# Altium schematic sheet FMU_FMU_REV_1B.SchDoc: The Cube TM
size A3; DrawnBy: Philip Rowse; SheetNumber: 1; SheetTotal: 10
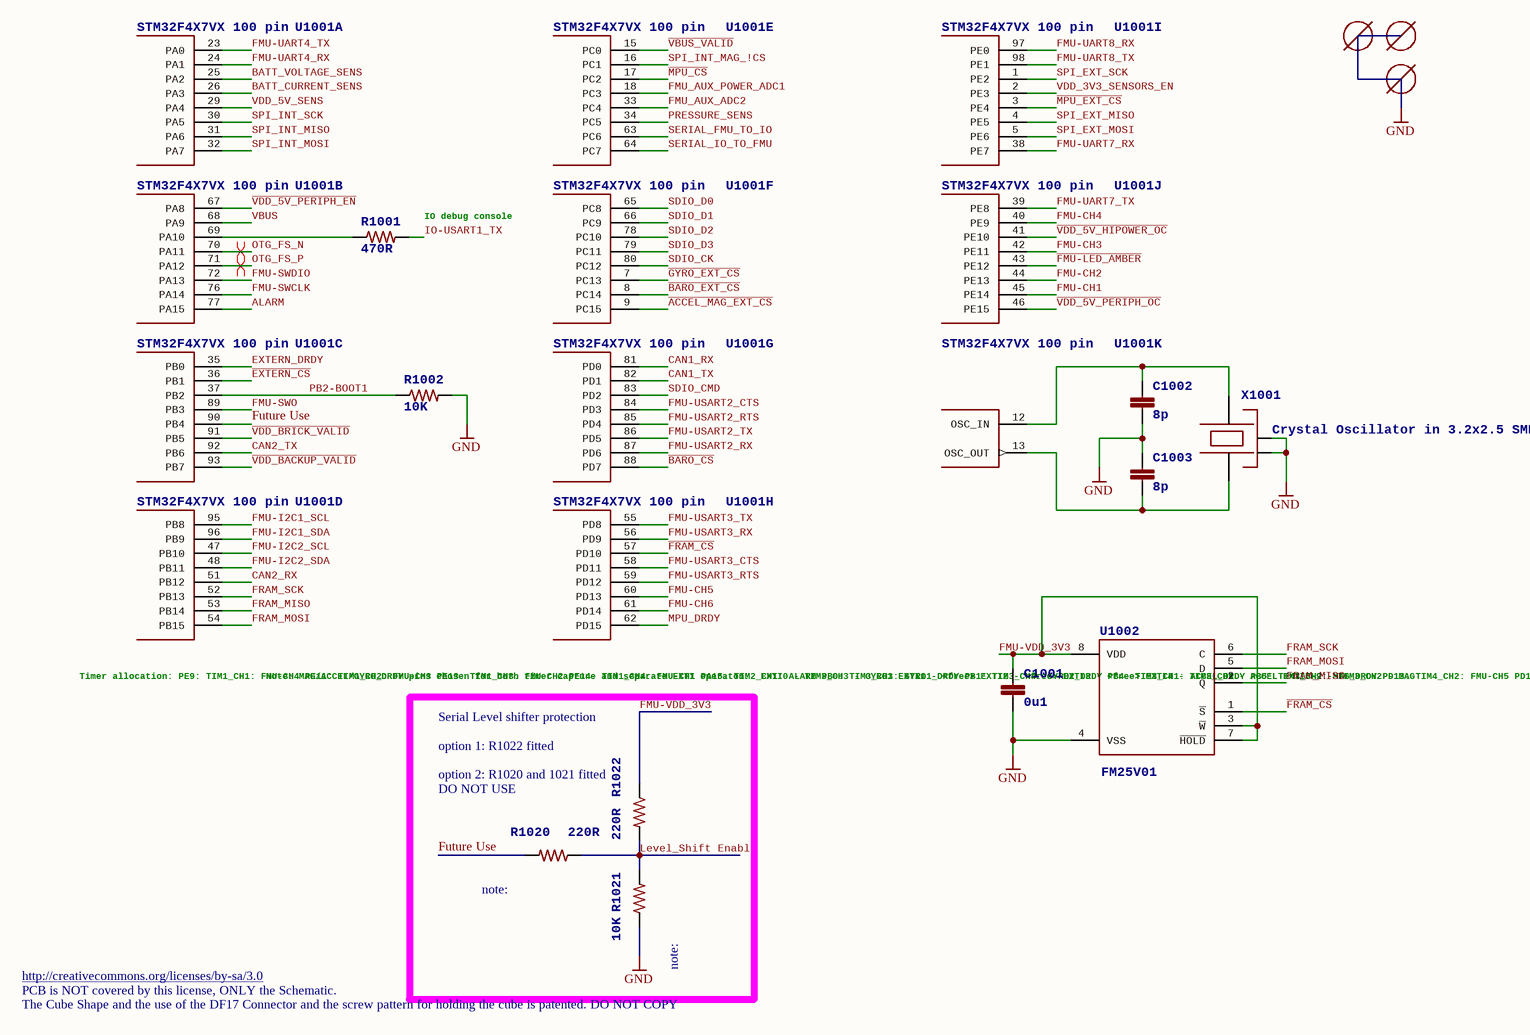
[diagram p0: FMU_FMU_REV_1B.SchDoc]

## Parts
C1001  0u1  [0402-CAP]
C1002  8p  [0402-CAP]
C1003  8p  [0402-CAP]
M3_MOUNT1001  MOUNT-HOLE1.8MM  [MOUNT-HOLE1.8]  (value not drawn)
M3_MOUNT1003  MOUNT-HOLE1.8MM  [MOUNT-HOLE1.8]  (value not drawn)
M3_MOUNT1004  MOUNT-HOLE1.8MM  [MOUNT-HOLE1.8]  (value not drawn)
R1001  470R  [0402-RES]
R1002  10K  [0402-RES]
R1020  220R  [0402-RES]
R1021  10K  [0402-RES]
R1022  220R  [0402-RES]
U1001  STM32F4X7VX 100 pin  [TQFP100]  (parts A,B,C,D,E,F,G,H,I,J,K of 14)
U1002  FM25V01  [SO08]
X1001  Crystal Oscillator in 3.2x2.5 SMD  [OSCILLATOR-3.2X2.5]

## Nets
GND: C1001.P$2 C1002.P$2 C1003.P$1 R1002.P$2 R1021.P$1 U1002.4(VSS) X1001.2(NC_2) X1001.4(NC_4)
~{ACCEL_MAG_EXT_CS}: U1001.9(PC15)
ALARM: U1001.77(PA15)
~{BARO_CS}: U1001.88(PD7)
~{BARO_EXT_CS}: U1001.8(PC14)
BATT_CURRENT_SENS: U1001.26(PA3)
BATT_VOLTAGE_SENS: U1001.25(PA2)
CAN1_RX: U1001.81(PD0)
CAN1_TX: U1001.82(PD1)
CAN2_RX: U1001.51(PB12)
CAN2_TX: U1001.92(PB6)
~{EXTERN_CS}: U1001.36(PB1)
EXTERN_DRDY: U1001.35(PB0)
~{FMU-LED_AMBER}: U1001.43(PE12)
~{FRAM_CS}: U1001.57(PD10) U1002.1(~{S})
FMU-CH1: U1001.45(PE14)
FMU-CH2: U1001.44(PE13)
FMU-CH3: U1001.42(PE11)
FMU-CH4: U1001.40(PE9)
FMU-CH5: U1001.60(PD13)
FMU-CH6: U1001.61(PD14)
FMU-I2C1_SCL: U1001.95(PB8)
FMU-I2C1_SDA: U1001.96(PB9)
FMU-I2C2_SCL: U1001.47(PB10)
FMU-I2C2_SDA: U1001.48(PB11)
FMU-SWCLK: U1001.76(PA14)
FMU-SWDIO: U1001.72(PA13)
FMU-SWO: U1001.89(PB3)
FMU-UART4_RX: U1001.24(PA1)
FMU-UART4_TX: U1001.23(PA0)
FMU-UART7_RX: U1001.38(PE7)
FMU-UART7_TX: U1001.39(PE8)
FMU-UART8_RX: U1001.97(PE0)
FMU-UART8_TX: U1001.98(PE1)
FMU-USART2_CTS: U1001.84(PD3)
FMU-USART2_RTS: U1001.85(PD4)
FMU-USART2_RX: U1001.87(PD6)
FMU-USART2_TX: U1001.86(PD5)
FMU-USART3_CTS: U1001.58(PD11)
FMU-USART3_RTS: U1001.59(PD12)
FMU-USART3_RX: U1001.56(PD9)
FMU-USART3_TX: U1001.55(PD8)
FMU-VDD_3V3: C1001.P$1 R1022.P$1 U1002.3(~{W}) U1002.7(~{HOLD}) U1002.8(VDD)
FMU_AUX_ADC2: U1001.33(PC4)
FMU_AUX_POWER_ADC1: U1001.18(PC3)
FRAM_MISO: U1001.53(PB14) U1002.2(Q)
FRAM_MOSI: U1001.54(PB15) U1002.5(D)
FRAM_SCK: U1001.52(PB13) U1002.6(C)
Future Use: R1020.P$2 U1001.90(PB4)
~{GYRO_EXT_CS}: U1001.7(PC13)
IO-USART1_TX: R1001.P$2
Level_Shift Enable: R1020.P$1 R1021.P$2 R1022.P$2
~{MPU_CS}: U1001.17(PC2)
~{MPU_EXT_CS}: U1001.3(PE4)
MPU_DRDY: U1001.62(PD15)
OTG_FS_N: U1001.70(PA11)
OTG_FS_P: U1001.71(PA12)
PB2-BOOT1: R1002.P$1 U1001.37(PB2)
PRESSURE_SENS: U1001.34(PC5)
SDIO_CK: U1001.80(PC12)
SDIO_CMD: U1001.83(PD2)
SDIO_D0: U1001.65(PC8)
SDIO_D1: U1001.66(PC9)
SDIO_D2: U1001.78(PC10)
SDIO_D3: U1001.79(PC11)
SERIAL_FMU_TO_IO: U1001.63(PC6)
SERIAL_IO_TO_FMU: U1001.64(PC7)
SPI_EXT_MISO: U1001.4(PE5)
SPI_EXT_MOSI: U1001.5(PE6)
SPI_EXT_SCK: U1001.1(PE2)
SPI_INT_MAG_!CS: U1001.16(PC1)
SPI_INT_MISO: U1001.31(PA6)
SPI_INT_MOSI: U1001.32(PA7)
SPI_INT_SCK: U1001.30(PA5)
~{VBUS_VALID}: U1001.15(PC0)
~{VDD_5V_HIPOWER_OC}: U1001.41(PE10)
~{VDD_5V_PERIPH_EN}: U1001.67(PA8)
~{VDD_5V_PERIPH_OC}: U1001.46(PE15)
~{VDD_BACKUP_VALID}: U1001.93(PB7)
~{VDD_BRICK_VALID}: U1001.91(PB5)
VBUS: U1001.68(PA9)
VDD_3V3_SENSORS_EN: U1001.2(PE3)
VDD_5V_SENS: U1001.29(PA4)
NetC1002_P$1: C1002.P$1 U1001.12(OSC_IN) X1001.3
NetC1003_P$2: C1003.P$2 U1001.13(OSC_OUT) X1001.1
NetR1001_P$1: R1001.P$1 U1001.69(PA10)

## Layout directives
differential pair: OTG_FS_N, OTG_FS_P

## Notes on the sheet
- (near R1001) IO debug console
- Timer allocation:
  PE9: TIM1_CH1: FMU-CH4
  PE11: TIM1_CH2: FMU-CH3
  PE13: TIM1_CH3: FMU-CH2
  PE14: TIM1_CH4: FMU-CH1
  PA15: TIM2_CH1: ALARM
  PB0: TIM3_CH3: GYRO1_DRDY
  PB1: TIM3_CH4: GYRO2_DRDY
  PB4: TIM3_CH1: ACCEL_DRDY
  PB5: TIM3_CH2: MAG_DRDY
  PD13: TIM4_CH2: FMU-CH5
  PD14: TIM4_CH3: FMU-CH6
  PD15: TIM4_CH4: spare
- Note: MAG/ACCEL/GYRO_DRDY pins chosen
  for both timer capture and separate
  EXTI operaton.
  EXTI0 - TIM3_CH3 - GYRO1
  EXTI1 - <free>
  EXTI2 - <free>
  EXTI3 - <free>
  EXTI4 - TIM3_CH1 - ACCEL
  EXTI5-9 - TIM3_CH2 - MAG
- option 1: R1022 fitted
- (near R1022) option 2: R1020 and 1021 fitted
- Serial Level shifter protection
- DO NOT USE
- http://creativecommons.org/licenses/by-sa/3.0
- PCB is NOT covered by this license, ONLY the Schematic.
- The Cube Shape and the use of the DF17 Connector and the screw pattern for holding the cube is patented. DO NOT COPY
- Title
- Size:
- Date:
- A3
- Number:
- Time:
- Revision:
- Sheet
- of
- File:

## Library data of the parts
C1001 = CAP0402: CAP CER 0.1UF 16V Y5V 0402; Value: 0u1
C1002 C1003 = CAP0402: CAP CER 8PF 50V C0G 0402; Value: 8p
R1001 = RESISTOR0402-RES: RES 470 OHM 1/16W 1% 0402 SMD; Value: 470R
R1002 R1021 = RESISTOR0402-RES: RES 10K OHM 1/16W 1% 0402 SMD; Value: 10K
R1020 R1022 = RESISTOR0402-RES: RES 220 OHM 1/16W 1% 0402 SMD; Value: 220R
U1001 = STM32F4X7VX: REV 3 Silicon or later IC MCU ARM 2MB FLASH 100LQFP
U1002 = FM25V01: IC FRAM 128KBIT 40MHZ 8SOIC; Value: 128k
X1001 = OSCILLATOR-3.2X2.5: CRYSTAL 24MHZ 8PF SMD; Value: 24MHz